# Altium schematic sheet SENSOR_SHEET.SchDoc
size A4; SheetNumber: 22; SheetTotal: 27
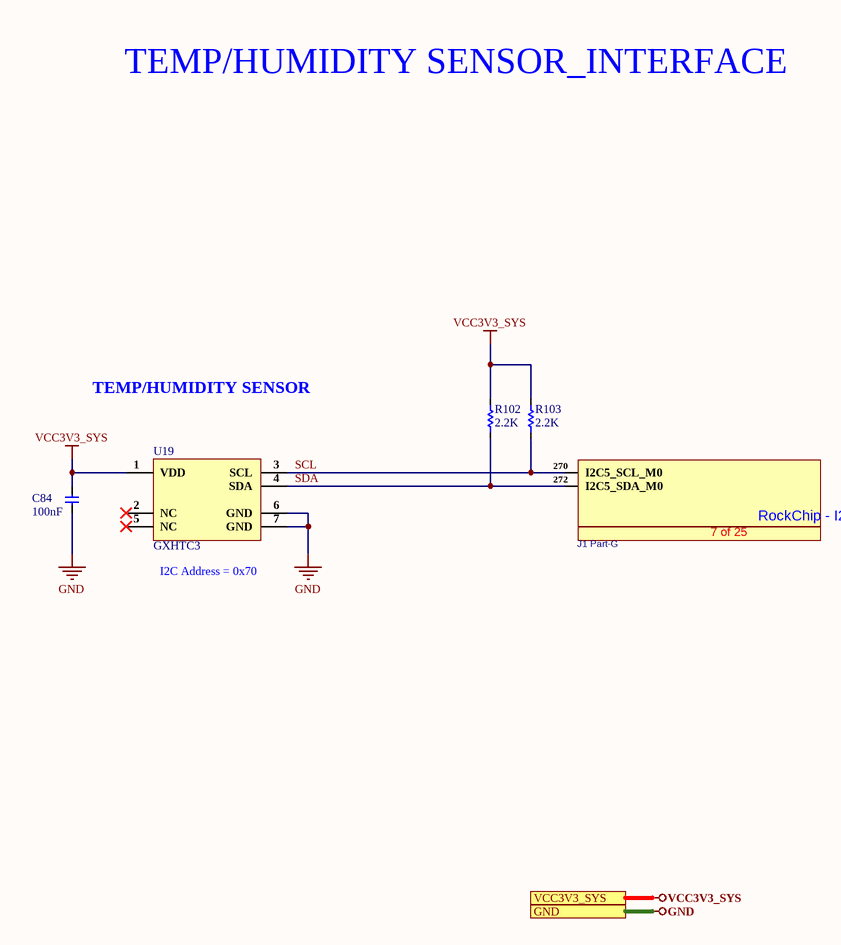
[diagram p0: SENSOR_SHEET.SchDoc]

## Parts
C84  100nF  [Cap-0402]
J1_Part-  AS0B826-S78B-7H  [AS0B826-S78B-7H]  (value not drawn)  (part G of 25)
R102  2.2K  [Res-0402]
R103  2.2K  [Res-0402]
U19  GXHTC3  [DFN-6-EP(2x2)]

## Ports
GND (see TOP SHEET[2D], AUDIO_INTERFACE[1D], BUCK REGULATOR[3D], DEBUG_UART_INTERFACE[3D], DIGITAL IO_RELAY_SHEET[5D], DUAL_SIM_INTERFACE[3D], ETHERNET_PHY0[4D], ETHERNET_PHY1[4D], GSM_INTERFACE[2D], HDMI_INTERFACE[3D], INPUT_PROTECTION[3D], LINEAR_VOLTAGE_REG[3D], MICRO_SD_INTERFACE[3D], MIPI-DSI DISPLAY[3D], POWER SECTION[3D], PUSH BUTTONs_INTERFACE[3C], RGB_LEDs_INTERFACE[3D], ROCKCHIP_PWR_SUPPLY[1D], ROCKCHIP_SYSTEM_CONTROL[3C], RS232_RS485_INTERFACE[3C], USB2.0_INTERFACE[3D], USB3.0_INTERFACE[3D], USB-C_INTERFACE[2D], WIEGAND_INTERFACE[3D], WIFI_BLUETOOTH_SHEET[4C]), VCC3V3_SYS (see TOP SHEET[2D], AUDIO_INTERFACE[1D], BUCK REGULATOR[3D], DEBUG_UART_INTERFACE[3D], DIGITAL IO_RELAY_SHEET[5D], ETHERNET_PHY0[4D], ETHERNET_PHY1[4D], GSM_INTERFACE[2D], HDMI_INTERFACE[3D], LINEAR_VOLTAGE_REG[3D], MIPI-DSI DISPLAY[3D], POWER SECTION[3D], PUSH BUTTONs_INTERFACE[3C], ROCKCHIP_PWR_SUPPLY[1D], ROCKCHIP_SYSTEM_CONTROL[3C], RS232_RS485_INTERFACE[3C], USB-C_INTERFACE[2D], WIEGAND_INTERFACE[3D], WIFI_BLUETOOTH_SHEET[4C])

## Nets
GND: C84.1 U19.6(GND) U19.7(GND) ; port GND
VCC3V3_SYS: C84.2 R102.2 R103.2 U19.1(VDD) ; port VCC3V3_SYS
SCL: J1_Part-.270(I2C5_SCL_M0) R103.1 U19.3(SCL)
SDA: J1_Part-.272(I2C5_SDA_M0) R102.1 U19.4(SDA)

Not connected (* = marked no-connect by the designer): U19 2(NC)* 5(NC)*

## Notes on the sheet
- TEMP/HUMIDITY SENSOR_INTERFACE
- TEMP/HUMIDITY SENSOR
- (near U19) I2C Address = 0x70
- File:
- Title:
- Date:
- Page
- Num:
- Total:
- Drawn By: Huzaifa Ali
- (in symbol AS0B826-S78B-7H, part G) RockChip - I2C5; 7 of 25

## Library data of the parts
C84 = CC0402KRX5R7BB104: CAP CER 0.1UF 16V X5R 0402; Manufacturer: Yageo; Tolerance: 10%; Manufacturer Part Number: CC0402KRX5R7BB104; RoHS: Yes; Category: Ceramic Capacitors; Supplier 1: Mouser; Stock 1: 936792; Pricing 1: 1=0.10000, 10=0.02300, 50=0.02300, 100=0.01100, 1000=0.00600, 10000=0.00400 (USD); Mount: Surface Mount; Case/Package: 0402; Number of Pins: 2; Case Code (Metric): 1005; Case Code (Imperial): 0402; Min Operating Temperature: -55°C; Max Operating Temperature: 85°C; Capacitance: 100nF; Dielectric: X5R; Packaging: Tape and Reel; Voltage Rating: 16V; Package Quantity: 1; Voltage Rating (DC): 16V; Termination: SMD/SMT; Resistor Type: Ceramic; Series: CC; Construction: Flat; Length: 1mm; Width: 0.02inch; Height: 0.5mm; Thickness: 0.022inch; Depth: 0.5mm; Radiation Hardening: No; REACH SVHC: Unknown; Lead Free: Lead Free; Halogen Free: Halogen Free; RoHS Compliant: Yes; ComponentLink1URL: https://datasheet.ciiva.com/155/mlccorderingcode-155879.pdf?src-supplier=Digi-Key; ComponentLink1Description: https://datasheet.ciiva.com/155/mlccorderingcode-155879.pdf?src-supplier=Digi-Key; ComponentLink2URL: https://datasheet.ciiva.com/155/mlccorderingcode-155878.pdf?src-supplier=Digi-Key; ComponentLink2Description: https://datasheet.ciiva.com/155/mlccorderingcode-155878.pdf?src-supplier=Digi-Key; ComponentLink3URL: https://datasheet.ciiva.com/155/mlccorderingcode-155880.pdf?src-supplier=Digi-Key; ComponentLink3Description: https://datasheet.ciiva.com/155/mlccorderingcode-155880.pdf?src-supplier=Digi-Key; ComponentLink4URL: https://datasheet.ciiva.com/11464/upy-gphc-x5r-4v-to-50v-12-11464869.pdf?src-supplier=Avnet; ComponentLink4Description: https://datasheet.ciiva.com/11464/upy-gphc-x5r-4v-to-50v-12-11464869.pdf?src-supplier=Avnet; Supplier Part Number 1: 603-CC402KRX5R7BB104; LCSC Part Number: C106204
J1_Part- = AS0B826-S78B-7H: SMD,P=0.5mm,Surface Mount，Right Angle; Manufacturer: FOXCONN; Item Type: Card Edge Connectors; Supplier: LCSC; Manufacturer Part Number: AS0B826-S78B-7H; RoHS: No; Stock: 4979; Pricing: 1=9.21, 10=8.287, 25=7.8064, 50=7.6064, 100=7.4062 (USD); LCSC Part Number: C426232
R102 R103 = RC0402FR-072K2L: RES SMD 2.2K OHM 1% 1/16W 0402; Manufacturer: Yageo; Power Rating: 63mW; Resistance: 2.2kR; Voltage Rating: 50V; Temperature Coefficient: 100ppm/°C; Supplier 1: Digi-Key; Manufacturer Part Number: RC0402FR-072K2L; Stock 1: 966157; Pricing 1: 1=0.1, 10=0.016, 100=0.0066, 1000=0.00299, 2500=0.00259, 5000=0.00214 (USD); Case/Package: 0402; Case Code (Imperial): 0402; Case Code (Metric): 1005; Size Code: 0402; Min Operating Temperature: -55°C; Max Operating Temperature: 155°C; Tolerance: 1%; Packaging: Tape and Reel; Resistor Type: Thick Film; Termination: SMD/SMT; Features: Moisture Resistant; Series: RC; Max Power Dissipation: 63mW; Number of Terminations: 2; Resistance Tolerance: 1%; Construction: Rectangular; Length: 1mm; Width: 0.5mm; Height: 0.35mm; Depth: 0.5mm; RoHS Compliant: Yes; Military Standard: Not; Lead Free: Lead Free; ComponentLink1URL: http://www.farnell.com/datasheets/2167052.pdf?src-supplier=Element14; ComponentLink1Description: http://www.farnell.com/datasheets/2167052.pdf?src-supplier=Element14; ComponentLink2URL: http://www.yageo.com/documents/recent/PYu-RC_Group_51_RoHS_L_9.pdf?src-supplier=Mouser; ComponentLink2Description: http://www.yageo.com/documents/recent/PYu-RC_Group_51_RoHS_L_9.pdf?src-supplier=Mouser; ComponentLink3URL: http://documents.rs-components.com/techlib://itc_doclist_GB.htm?stockno=6186532&src-supplier=RSComponents; ComponentLink3Description: http://documents.rs-components.com/techlib://itc_doclist_GB.htm?stockno=6186532&src-supplier=RSComponents; ComponentLink4URL: http://www.yageo.com/documents/recent/PYu-RC0402_51_RoHS_L_6_r.pdf?src-supplier=Future+Electronics; ComponentLink4Description: http://www.yageo.com/documents/recent/PYu-RC0402_51_RoHS_L_6_r.pdf?src-supplier=Future+Electronics; Supplier Part Number 1: 311-2.20KLRCT-ND; LCSC Part Number: C114762; Weight: 2.3E-05oz; Technology: THICK FILM; REACH SVHC: Unknown
U19 = GXHTC3: DFN-6-EP(2x2) Temperature and Humidity Sensor ROHS; Manufacturer: GXCAS; Item Type: Temperature & Humidity Sensor; Manufacturer Part Number: GXHTC3; Package: DFN-6-EP(2x2); LCSC Part Number: C2837688; ComponentLink1Description: LCSC; ComponentLink1URL: https://www.lcsc.com/product-detail/Temperature-and-Humidity-Sensor_GXCAS-GXHTC3_C2837688.html